# Altium schematic sheet power-synth.SchDoc: Synthesizer - LDO
size Letter; CheckedBy: J. Brinton; CompanyName: Signal Laboratories, Inc.; DrawnBy: J. Brinton; Engineer: J. Brinton; Address1: 3479 Edison Way; Address2: Menlo Park CA 94025; Address3: +1 (877) 778-8435; Address4: siglabs.com; Revision: 3; SheetNumber: 35; SheetTotal: 49
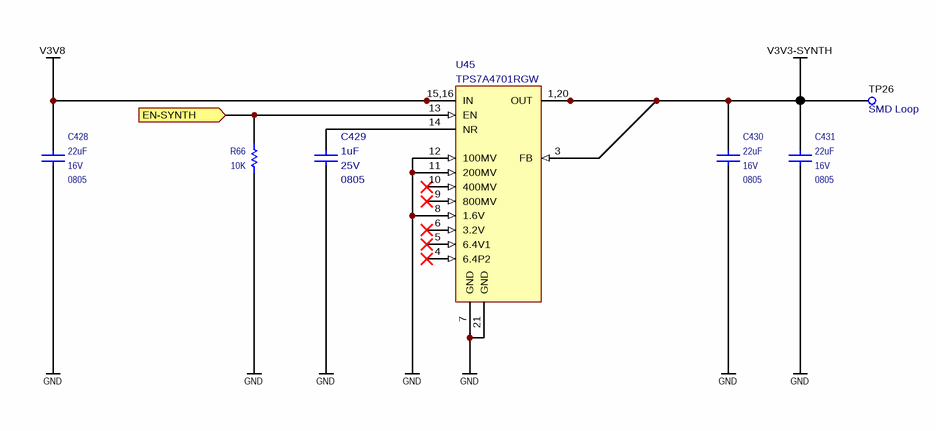
[diagram p0: power-synth.SchDoc]

## Parts
C428  value 22uF  Voltage: 16V  Package: 0805  [CAPC200X125X145L45N]  (hidden comment: CL21A226KOQNNNE)
C429  value 1uF  Package: 0805  Voltage: 25V  [CAPC200X125X145L45N]  (hidden comment: TMK212B7105KG)
C430  value 22uF  Voltage: 16V  Package: 0805  [CAPC200X125X145L45N]  (hidden comment: CL21A226KOQNNNE)
C431  value 22uF  Voltage: 16V  Package: 0805  [CAPC200X125X145L45N]  (hidden comment: CL21A226KOQNNNE)
R66  value 10K  [RESC1005X40N]  (hidden comment: ERJ-2RKF1002X)
TP26  Notes: SMD Loop  [5015]  (hidden comment: 5015)
U45  TPS7A4701RGW  [QFN65P500X500X100-21N]

## Ports
EN-SYNTH (in)

## Nets
GND: C428.1 C429.2 C430.1 C431.1 R66.2 U45.7(GND) U45.8(1.6V) U45.11(200MV) U45.12(100MV) U45.21(GND)
V3V3-SYNTH: C430.2 C431.2 TP26.1 U45.1(OUT) U45.3(FB) U45.20(OUT)
V3V8: C428.2 U45.15(IN) U45.16(IN)
EN-SYNTH: R66.1 U45.13(EN) ; port EN-SYNTH
NetC429_1: C429.1 U45.14(NR)

Not connected (* = marked no-connect by the designer): U45 4(6.4P2)* 5(6.4V1)* 6(3.2V)* 9(800MV)* 10(400MV)*

## Notes on the sheet
- Title
- Engineer
- Revision
- Drawn By
- Checked By
- Date
- Sheet
- of
- (in symbol TPS7A4701RGW_1) 15,16; 1,20

## Library data of the parts
C428 C430 C431 = CAP 0603: Ceramic Capacitor 22uF ±10% 16V X5R 0805; Manufacturer: Samsung; Tr: -55:85; Manufacturer P/N: CL21A226KOQNNNE; Tolerance: ±10%
C429 = TMK212B7105KG: Ceramic Capacitor 1uF ±10% 25V X7R 0805; Manufacturer: Taiyo Yuden; Manufacturer P/N: TMK212B7105KG; Tolerance: ±10%; Tr: *
R66 = RES 0402: Thick Film Resistor 10k ±1% 0.1W 50V 0402; Manufacturer: Panasonic; Tr: -55:155; Package: 0402; Manufacturer P/N: ERJ-2RKF1002X; Tolerance: ±1%
TP26 = TEST_POINT_SMD_50: Test Point SMD; Manufacturer: Keystone; Manufacturer P/N: 5015
U45 = TPS7A4701RGW_1: Low-Dropout Linear Regulator 20-VQFN; Manufacturer: Texas Instruments; Manufacturer P/N: TPS7A4701RGW; Package: VQFN-20